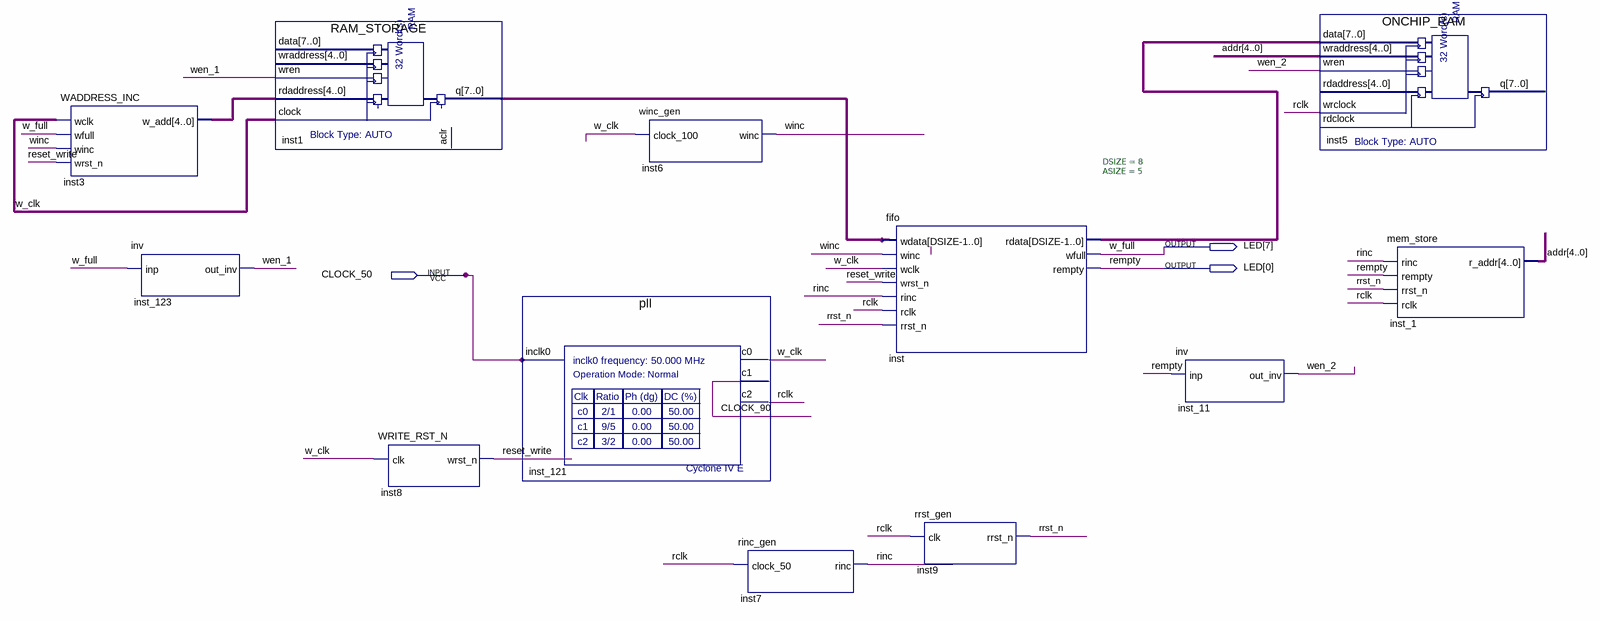
[diagram p0: schematic sheet]
// Quartus schematic HARDWARE_TESTING.bdf as structural Verilog: 12 symbols, 3 pins
module HARDWARE_TESTING (
  input  CLOCK_50,
  output [7:0] LED
);

  wire CLOCK_90, rclk, reset_write, rinc, rrst_n, w_clk, wen_1, wen_2, winc;
  wire [4:0] addr, inst3_w_add;
  wire [7:0] inst1_q, inst_rdata;

  WADDRESS_INC inst3 (.wclk(w_clk), .wfull(LED[7]), .winc(winc), .wrst_n(reset_write), .w_add(inst3_w_add));
  inv inst_123 (.inp(LED[7]), .out_inv(wen_1));
  RAM_STORAGE inst1 (.wren(wen_1), .rdaddress(inst3_w_add), .clock(w_clk), .q(inst1_q));  // open: data, wraddress, aclr
  WRITE_RST_N inst8 (.clk(w_clk), .wrst_n(reset_write));
  pll inst_121 (.inclk0(CLOCK_50), .c0(w_clk), .c1(CLOCK_90), .c2(rclk));
  winc_gen inst6 (.clock_100(w_clk), .winc(winc));
  rinc_gen inst7 (.clock_50(rclk), .rinc(rinc));
  fifo #(.DSIZE(8), .ASIZE(5)) inst (
    .wdata(inst1_q), .winc(winc), .wclk(w_clk), .wrst_n(reset_write), .rinc(rinc), .rclk(rclk),
    .rrst_n(rrst_n), .rdata(inst_rdata), .wfull(LED[7]), .rempty(LED[0]));
  rrst_gen inst9 (.clk(rclk), .rrst_n(rrst_n));
  inv inst_11 (.inp(LED[0]), .out_inv(wen_2));
  ONCHIP_RAM inst5 (.data(inst_rdata), .wraddress(addr), .wren(wen_2), .wrclock(rclk));  // open: rdaddress, rdclock, q
  mem_store inst_1 (.rinc(rinc), .rempty(LED[0]), .rrst_n(rrst_n), .rclk(rclk), .r_addr(addr));

  // Other names for the same wires on the sheet: w_full = LED[7]; rempty = LED[0]
endmodule
